# Altium project PCB_Project2.PrjPCB
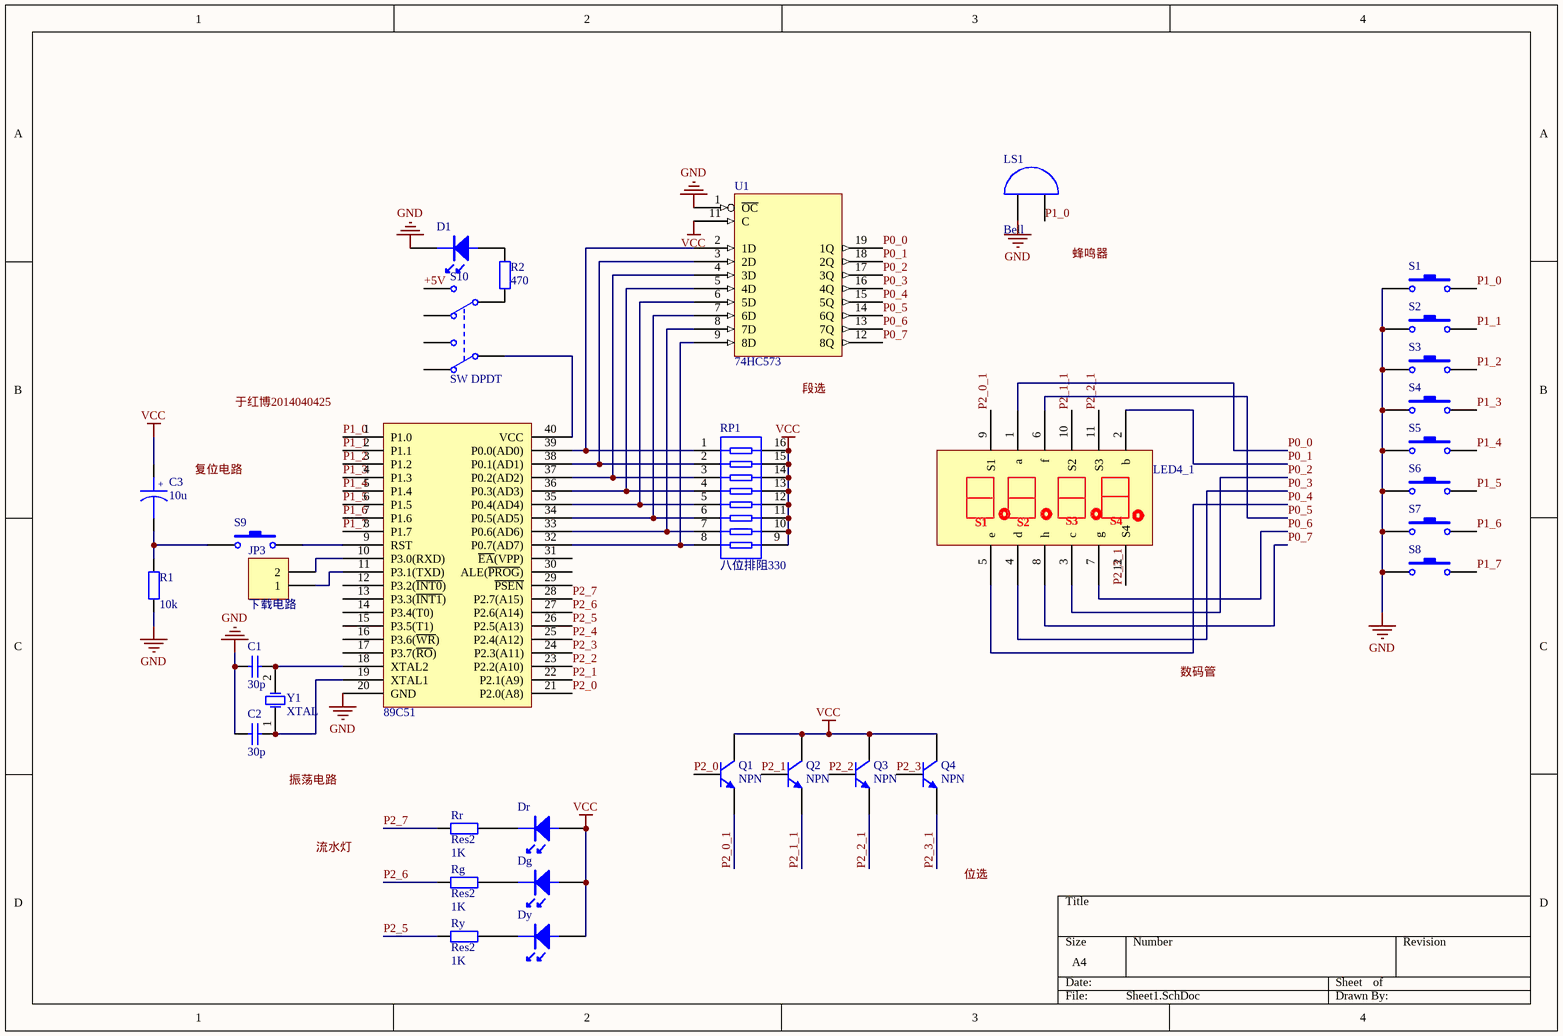
[diagram p0: Sheet1.SchDoc]
1 sheet, 33 parts. Net scope: global (net labels, ports and power ports of the same name join across sheets).
Board file: PCB1.PcbDoc

## Sheet Sheet1.SchDoc
size A4

### Parts
89c51  89C51  [DIP40]
C1  30p  [RAD-0.3]
C2  30p  [RAD-0.3]
C3  10u  [cap]
D1  发光二极管  [DIODE0.4A]  (value not drawn)
Dg  发光二极管阵列  [DIODE0.4A]  (value not drawn)
Dr  发光二极管阵列  [DIODE0.4A]  (value not drawn)
Dy  发光二极管阵列  [DIODE0.4A]  (value not drawn)
JP3  下载电路  [HDR1X2]
led4  LED4_1  [HDR2X6]
LS1  Bell  [PIN2]
Q1  NPN  [TO-226-AA]
Q2  NPN  [TO-226-AA]
Q3  NPN  [TO-226-AA]
Q4  NPN  [TO-226-AA]
R1  value 10k  [AXIAL-0.4]  (hidden comment: R1)
R2  470  [AXIAL-0.4]
Rg  Res2  value 1K  [AXIAL-0.4]
RP1  八位排阻330  [DIP16]
Rr  Res2  value 1K  [AXIAL-0.4]
Ry  Res2  value 1K  [AXIAL-0.4]
S1  SW-PB  [SPST-2]  (value not drawn)
S2  SW-PB  [SPST-2]  (value not drawn)
S3  SW-PB  [SPST-2]  (value not drawn)
S4  SW-PB  [SPST-2]  (value not drawn)
S5  SW-PB  [SPST-2]  (value not drawn)
S6  SW-PB  [SPST-2]  (value not drawn)
S7  SW-PB  [SPST-2]  (value not drawn)
S8  SW-PB  [SPST-2]  (value not drawn)
S9  SW-PB  [SPST-2]  (value not drawn)
S10  SW DPDT  [SOT23-6_N]
U1  74HC573  [DIP-20]
Y1  XTAL  [R38]

### Nets
GND: 89c51.20(GND) C1.1 C2.1 D1.K LS1.1(A) R1.1 S1.1 S2.1 S3.1 S4.1 S5.1 S6.1 S7.1 S8.1 U1.1(~{OC}) U1.10(GND)
VCC: C3.1 Dg.A Dr.A Dy.A Q1.1(C) Q2.1(C) Q3.1(C) Q4.1(C) RP1.9 RP1.10 RP1.11 RP1.12 RP1.13 RP1.14 RP1.15 RP1.16 U1.11(C) U1.20(VCC)
+5V: S10.6(NO2)
P0_0: led4.1(a) U1.19(1Q)
P0_1: led4.2(b) U1.18(2Q)
P0_2: led4.3(c) U1.17(3Q)
P0_3: led4.4(d) U1.16(4Q)
P0_4: led4.5(e) U1.15(5Q)
P0_5: led4.6(f) U1.14(6Q)
P0_6: led4.7(g) U1.13(7Q)
P0_7: led4.8(h) U1.12(8Q)
P1_0: 89c51.1(P1.0) LS1.2(B) S1.2
P1_1: 89c51.2(P1.1) S2.2
P1_2: 89c51.3(P1.2) S3.2
P1_3: 89c51.4(P1.3) S4.2
P1_4: 89c51.5(P1.4) S5.2
P1_5: 89c51.6(P1.5) S6.2
P1_6: 89c51.7(P1.6) S7.2
P1_7: 89c51.8(P1.7) S8.2
P2_0: 89c51.21(P2.0(A8)) Q1.2(B)
P2_0_1: led4.9(S1) Q1.3(E)
P2_1: 89c51.22(P2.1(A9)) Q2.2(B)
P2_1_1: led4.10(S2) Q2.3(E)
P2_2: 89c51.23(P2.2(A10)) Q3.2(B)
P2_2_1: led4.11(S3) Q3.3(E)
P2_3: 89c51.24(P2.3(A11)) Q4.2(B)
P2_3_1: led4.12(S4) Q4.3(E)
P2_4: 89c51.25(P2.4(A12))
P2_5: 89c51.26(P2.5(A13)) Ry.1
P2_6: 89c51.27(P2.6(A14)) Rg.1
P2_7: 89c51.28(P2.7(A15)) Rr.1
Net89c51_9: 89c51.9(RST) S9.2
Net89c51_10: 89c51.10(P3.0(RXD)) JP3.2
Net89c51_11: 89c51.11(P3.1(TXD)) JP3.1
Net89c51_18: 89c51.18(XTAL2) C1.2 Y1.2(OSC2)
Net89c51_19: 89c51.19(XTAL1) C2.2 Y1.1(OSC1)
Net89c51_32: 89c51.32(P0.7(AD7)) RP1.8 U1.9(8D)
Net89c51_33: 89c51.33(P0.6(AD6)) RP1.7 U1.8(7D)
Net89c51_34: 89c51.34(P0.5(AD5)) RP1.6 U1.7(6D)
Net89c51_35: 89c51.35(P0.4(AD4)) RP1.5 U1.6(5D)
Net89c51_36: 89c51.36(P0.3(AD3)) RP1.4 U1.5(4D)
Net89c51_37: 89c51.37(P0.2(AD2)) RP1.3 U1.4(3D)
Net89c51_38: 89c51.38(P0.1(AD1)) RP1.2 U1.3(2D)
Net89c51_39: 89c51.39(P0.0(AD0)) RP1.1 U1.2(1D)
Net89c51_40: 89c51.40(VCC) S10.1(COMMON1)
NetC3_2: C3.2 R1.2 S9.1
NetD1_A: D1.A R2.1
NetDg_K: Dg.K Rg.2
NetDr_K: Dr.K Rr.2
NetDy_K: Dy.K Ry.2
NetR2_2: R2.2 S10.5(COMMON2)

Not connected (* = marked no-connect by the designer): 89c51 12(P3.2(~{INT0})) 13(P3.3(~{INT1})) 14(P3.4(T0)) 15(P3.5(T1)) 16(P3.6(~{WR})) 17(P3.7(~{RO})) 29(~{PSEN}) 30(ALE(~{PROG})) 31(~{EA}(VPP)); S10 2(NC1) 3(NO1) 4(NC2)

### Notes on the sheet
- Labels drawn without touching a wire or pin: 位选, 于红博2014040425, 复位电路, 振荡电路, 数码管, 段选, 流水灯, 蜂鸣器
- Title
- Size:
- Date:
- A4
- Number:
- Time:
- Revision:
- Sheet
- of
- File:
- (in symbol 电解电容) +

### Library data of the parts
C1 C2 = Cap: Capacitor; Value: 0.1uF; Published: 8-Jun-2000; LatestRevisionDate: 17-Jul-2002; LatestRevisionNote: Re-released for DXP Platform.; PackageReference: RAD-0.3; Publisher: Altium Limited; PackageDescription: Radial Cap, Thru-Hole; 2 Leads; 0.3 in Pin Spacing
C3 = 电解电容: Capacitor
Dg Dr Dy = 发光二极管
JP3 = Header 2: Header, 2-Pin; LatestRevisionDate: 17-Jul-2002; LatestRevisionNote: Re-released for DXP Platform.; Publisher: Altium Limited
led4 = LED4_LWQ
LS1 = Bell: Electrical Bell; Published: 24-Mar-1999; LatestRevisionDate: 17-Jul-2002; LatestRevisionNote: Re-released for DXP Platform.; PackageReference: PIN2; Publisher: Altium Limited
Q1-Q4 = NPN: NPN Bipolar Transistor; Published: 8-Jun-2000; LatestRevisionDate: 17-Jul-2002; LatestRevisionNote: Re-released for DXP Platform.; PackageReference: TO-226-AA; Publisher: Altium Limited; PackageDescription: TO, Flat Index; 3 In-Line, Axial Leads; Body Dia. 4.8mm; Leads 0.55 x 0.51 mm (max); Code_JEDEC: TO-226-AA
R1 Rg Rr Ry = Res2: Resistor; Published: 8-Jun-2000; LatestRevisionDate: 17-Jul-2002; LatestRevisionNote: Re-released for DXP Platform.; PackageReference: AXIAL-0.4; Publisher: Altium Limited; PackageDescription: Axial Device, Thru-Hole; 2 Leads; 0.4 in Pin Spacing
R2 = Res2: Resistor; Value: 1K; Published: 8-Jun-2000; LatestRevisionDate: 17-Jul-2002; LatestRevisionNote: Re-released for DXP Platform.; PackageReference: AXIAL-0.4; Publisher: Altium Limited; PackageDescription: Axial Device, Thru-Hole; 2 Leads; 0.4 in Pin Spacing
RP1 = RESPACK4
S1-S9 = SW-PB: Switch; Published: 24-Mar-1999; LatestRevisionDate: 17-Jul-2002; LatestRevisionNote: Re-released for DXP Platform.; PackageReference: SPST-2; Publisher: Altium Limited; PackageDescription: Switch; 2 Leads
S10 = SW DPDT: Switch; Published: 24-Mar-1999; LatestRevisionDate: 29-May-2009; LatestRevisionNote: IPC-7351 Footprint Added.; PackageVersion: Mar-2001; PackageReference: SOT23-6; Publisher: Altium Limited; PackageDescription: 6-Pin SOT-23 Package 0.95 mm Pitch, 2.7 mm Lead Span; Code_JEITA: SC-74; Code_IPC: SOT26A-6
Y1 = XTAL: Crystal Oscillator; Published: 8-Jun-2000; LatestRevisionDate: 17-Jul-2002; LatestRevisionNote: Re-released for DXP Platform.; PackageReference: R38; Publisher: Altium Limited; PackageDescription: Crystal, Thru-Hole; 2 Leads; Body 3.1 x 8.2 mm (Dia.xH)